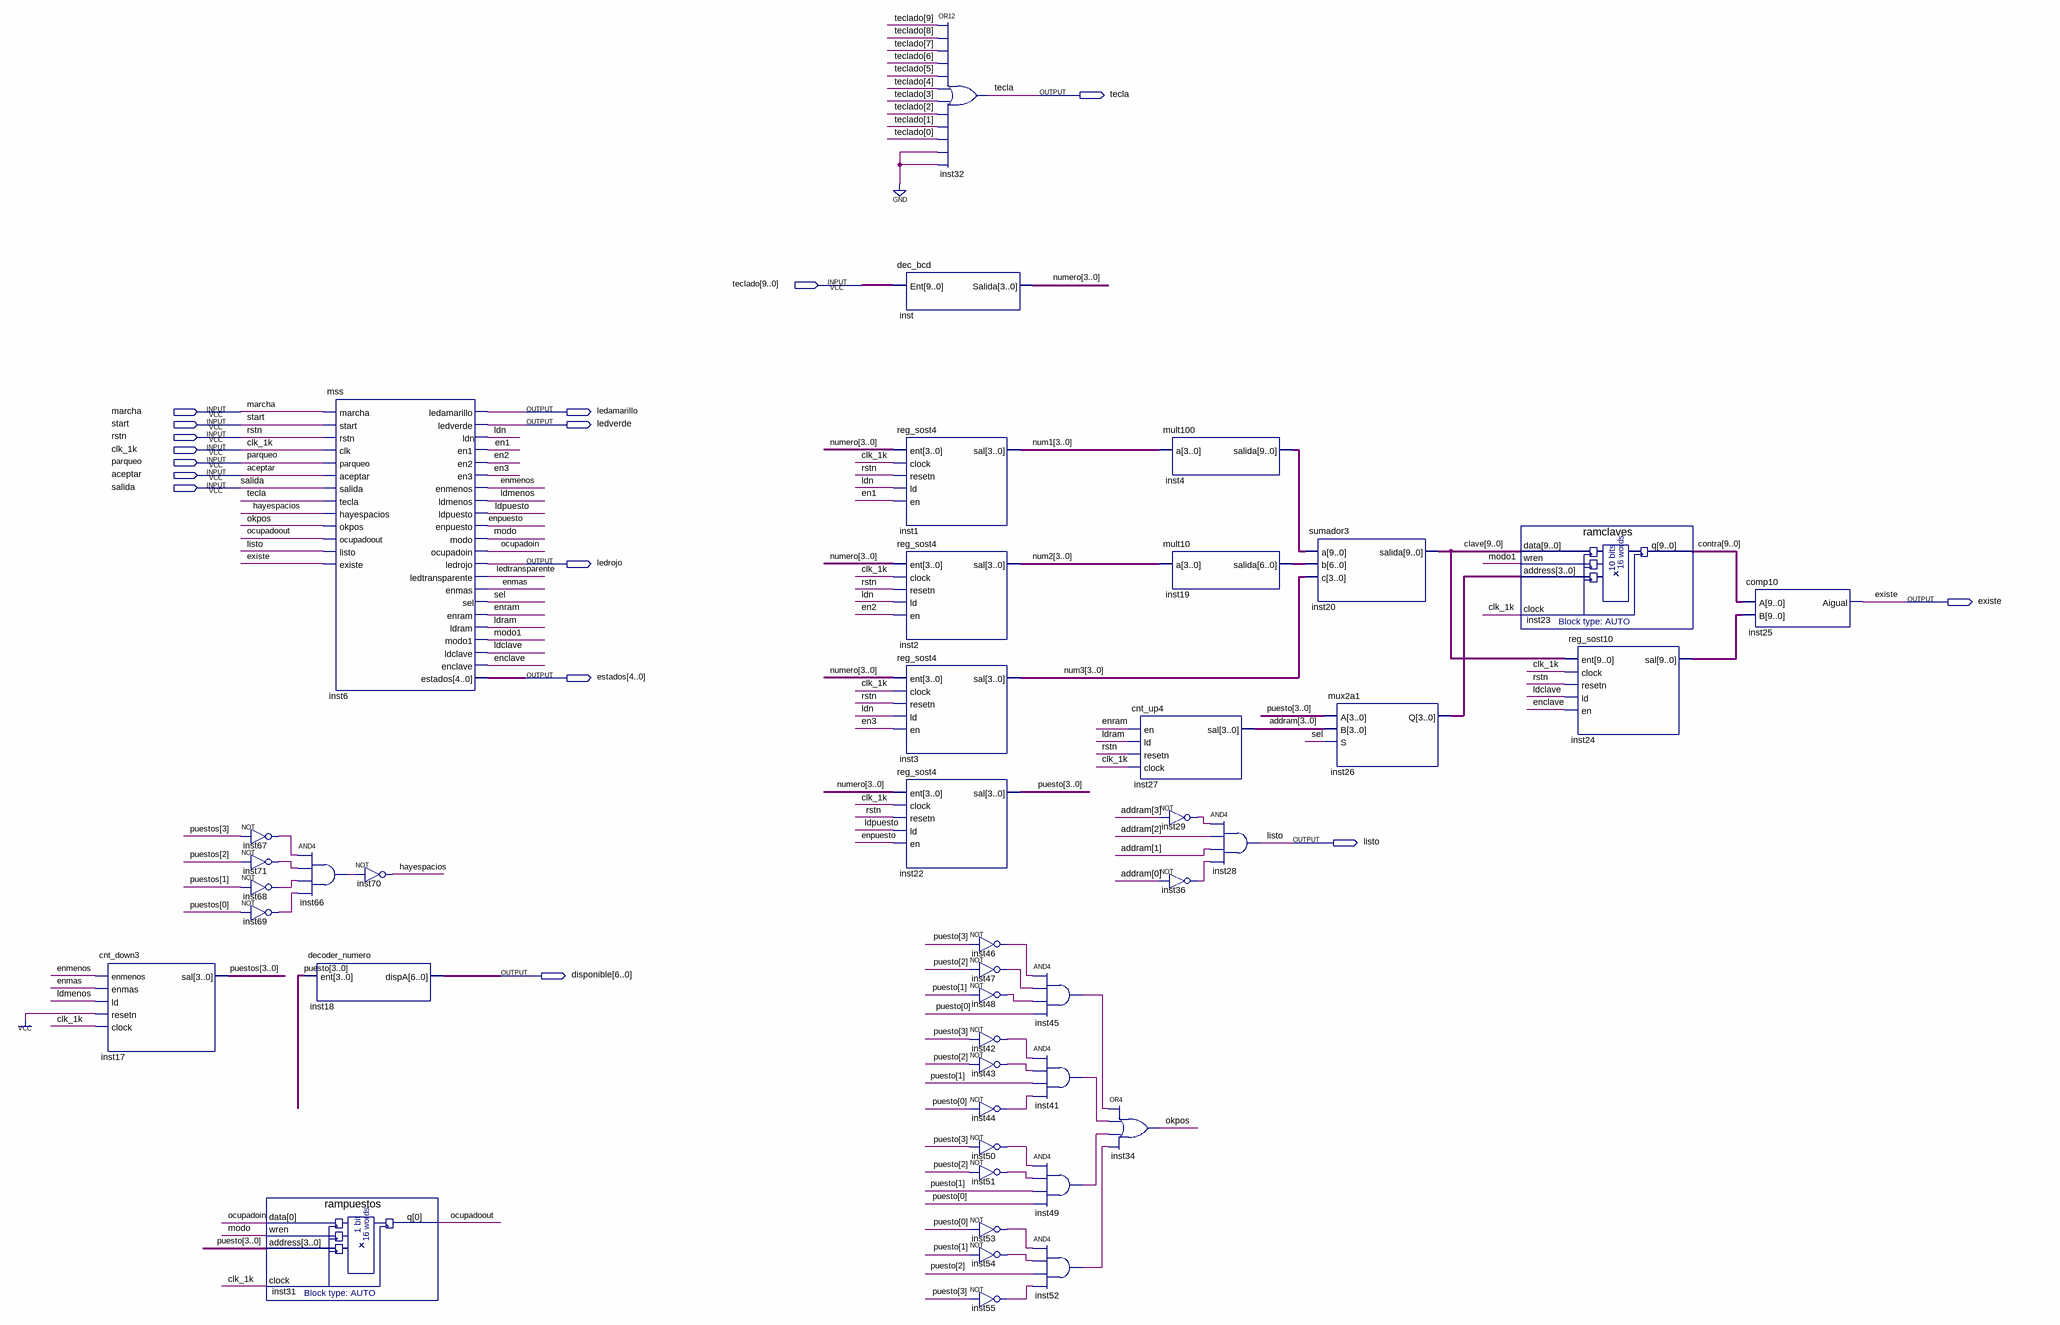
[diagram p0: schematic sheet]
// Quartus schematic particion.bdf as structural Verilog: 43 symbols, 16 pins
module particion (
  input  [9:0] teclado,
  input  marcha,
  input  start,
  input  rstn,
  input  clk_1k,
  input  parqueo,
  input  aceptar,
  input  salida,
  output tecla,
  output ledamarillo,
  output ledverde,
  output ledrojo,
  output existe,
  output [4:0] estados,
  output listo,
  output [6:0] disponible
);

  wire en1, en2, en3, enclave, enmas, enmenos, enpuesto, enram, hayespacios, inst29_out, inst36_out,
       inst41_out, inst42_out, inst43_out, inst44_out, inst45_out, inst46_out, inst47_out, inst48_out,
       inst49_out, inst50_out, inst51_out, inst52_out, inst53_out, inst54_out, inst55_out, inst66_out,
       inst67_out, inst68_out, inst69_out, inst71_out, ldclave, ldmenos, ldn, ldpuesto, ldram,
       ledtransparente, modo, modo1, ocupadoin, ocupadoout, okpos, sel;
  wire [3:0] addram, inst26_q, num1, num2, num3, numero, puesto, puestos;
  wire [6:0] inst19_salida;
  wire [9:0] clave, contra, inst4_salida, inst24_sal;

  cnt_down3 inst17 (.enmenos(enmenos), .enmas(enmas), .ld(ldmenos), .resetn(1'b1), .clock(clk_1k), .sal(puestos));
  not inst67 (inst67_out, puestos[3]);
  not inst71 (inst71_out, puestos[2]);
  not inst68 (inst68_out, puestos[1]);
  not inst69 (inst69_out, puestos[0]);
  and inst66 (inst66_out, inst67_out, inst71_out, inst68_out, inst69_out);
  decoder_numero inst18 (.ent(puesto), .dispA(disponible));
  rampuestos inst31 (.data(ocupadoin), .wren(modo), .address(puesto), .clock(clk_1k), .q(ocupadoout));
  mss inst6 (
    .marcha(marcha), .start(start), .rstn(rstn), .clk(clk_1k), .parqueo(parqueo), .aceptar(aceptar),
    .salida(salida), .tecla(tecla), .hayespacios(hayespacios), .okpos(okpos), .ocupadoout(ocupadoout),
    .listo(listo), .existe(existe), .ledamarillo(ledamarillo), .ledverde(ledverde), .ldn(ldn), .en1(en1),
    .en2(en2), .en3(en3), .enmenos(enmenos), .ldmenos(ldmenos), .ldpuesto(ldpuesto), .enpuesto(enpuesto),
    .modo(modo), .ocupadoin(ocupadoin), .ledrojo(ledrojo), .ledtransparente(ledtransparente), .enmas(enmas),
    .sel(sel), .enram(enram), .ldram(ldram), .modo1(modo1), .ldclave(ldclave), .enclave(enclave),
    .estados(estados));
  not inst70 (hayespacios, inst66_out);
  dec_bcd inst (.Ent(teclado), .Salida(numero));
  reg_sost4 inst1 (.ent(numero), .clock(clk_1k), .resetn(rstn), .ld(ldn), .en(en1), .sal(num1));
  reg_sost4 inst2 (.ent(numero), .clock(clk_1k), .resetn(rstn), .ld(ldn), .en(en2), .sal(num2));
  reg_sost4 inst3 (.ent(numero), .clock(clk_1k), .resetn(rstn), .ld(ldn), .en(en3), .sal(num3));
  reg_sost4 inst22 (.ent(numero), .clock(clk_1k), .resetn(rstn), .ld(ldpuesto), .en(enpuesto), .sal(puesto));
  or inst32 (tecla, teclado[9], teclado[8], teclado[7], teclado[6], teclado[5], teclado[4], teclado[3], teclado[2], teclado[1], teclado[0], 1'b0, 1'b0);
  not inst46 (inst46_out, puesto[3]);
  not inst47 (inst47_out, puesto[2]);
  not inst48 (inst48_out, puesto[1]);
  not inst42 (inst42_out, puesto[3]);
  not inst43 (inst43_out, puesto[2]);
  not inst44 (inst44_out, puesto[0]);
  not inst50 (inst50_out, puesto[3]);
  not inst51 (inst51_out, puesto[2]);
  not inst53 (inst53_out, puesto[0]);
  not inst54 (inst54_out, puesto[1]);
  not inst55 (inst55_out, puesto[3]);
  and inst45 (inst45_out, inst46_out, inst47_out, inst48_out, puesto[0]);
  and inst41 (inst41_out, inst42_out, inst43_out, puesto[1], inst44_out);
  and inst49 (inst49_out, inst50_out, inst51_out, puesto[1], puesto[0]);
  and inst52 (inst52_out, inst53_out, inst54_out, puesto[2], inst55_out);
  or inst34 (okpos, inst45_out, inst41_out, inst49_out, inst52_out);
  mult100 inst4 (.a(num1), .salida(inst4_salida));
  mult10 inst19 (.a(num2), .salida(inst19_salida));
  cnt_up4 inst27 (.en(enram), .ld(ldram), .resetn(rstn), .clock(clk_1k), .sal(addram));
  not inst29 (inst29_out, addram[3]);
  not inst36 (inst36_out, addram[0]);
  and inst28 (listo, inst29_out, addram[2], addram[1], inst36_out);
  sumador3 inst20 (.a(inst4_salida), .b(inst19_salida), .c(num3), .salida(clave));
  mux2a1 inst26 (.A(puesto), .B(addram), .S(sel), .Q(inst26_q));
  ramclaves inst23 (.data(clave), .wren(modo1), .address(inst26_q), .clock(clk_1k), .q(contra));
  reg_sost10 inst24 (.ent(clave), .clock(clk_1k), .resetn(rstn), .ld(ldclave), .en(enclave), .sal(inst24_sal));
  comp10 inst25 (.A(contra), .B(inst24_sal), .Aigual(existe));
endmodule
